# Altium schematic sheet PFTS-IN3-PCBV1.schdoc
size 69 x 45 mm
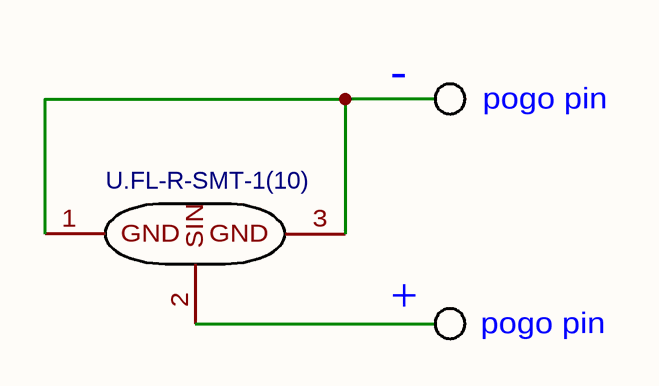
[diagram p0: PFTS-IN3-PCBV1.schdoc]

## Parts
JP1  U.FL-R-SMT-1(10)  [U.FL-R-SMT-1(10)]

## Nets
+: JP1.2(SIN)
-: JP1.1(GND) JP1.3(GND)

## Notes on the sheet
- pogo pin

## Library data of the parts
JP1 = (no symbol name): BOM_Manufacturer: HRS; BOM_Supplier: LCSC; BOM_Manufacturer Part: U.FL-R-SMT-1(10); BOM_LCSC: C88373; spicePre: J